# EAGLE schematic Lamp Logic Board_Combo (EAGLE 9.5.1)

## Sheet 1 of 3
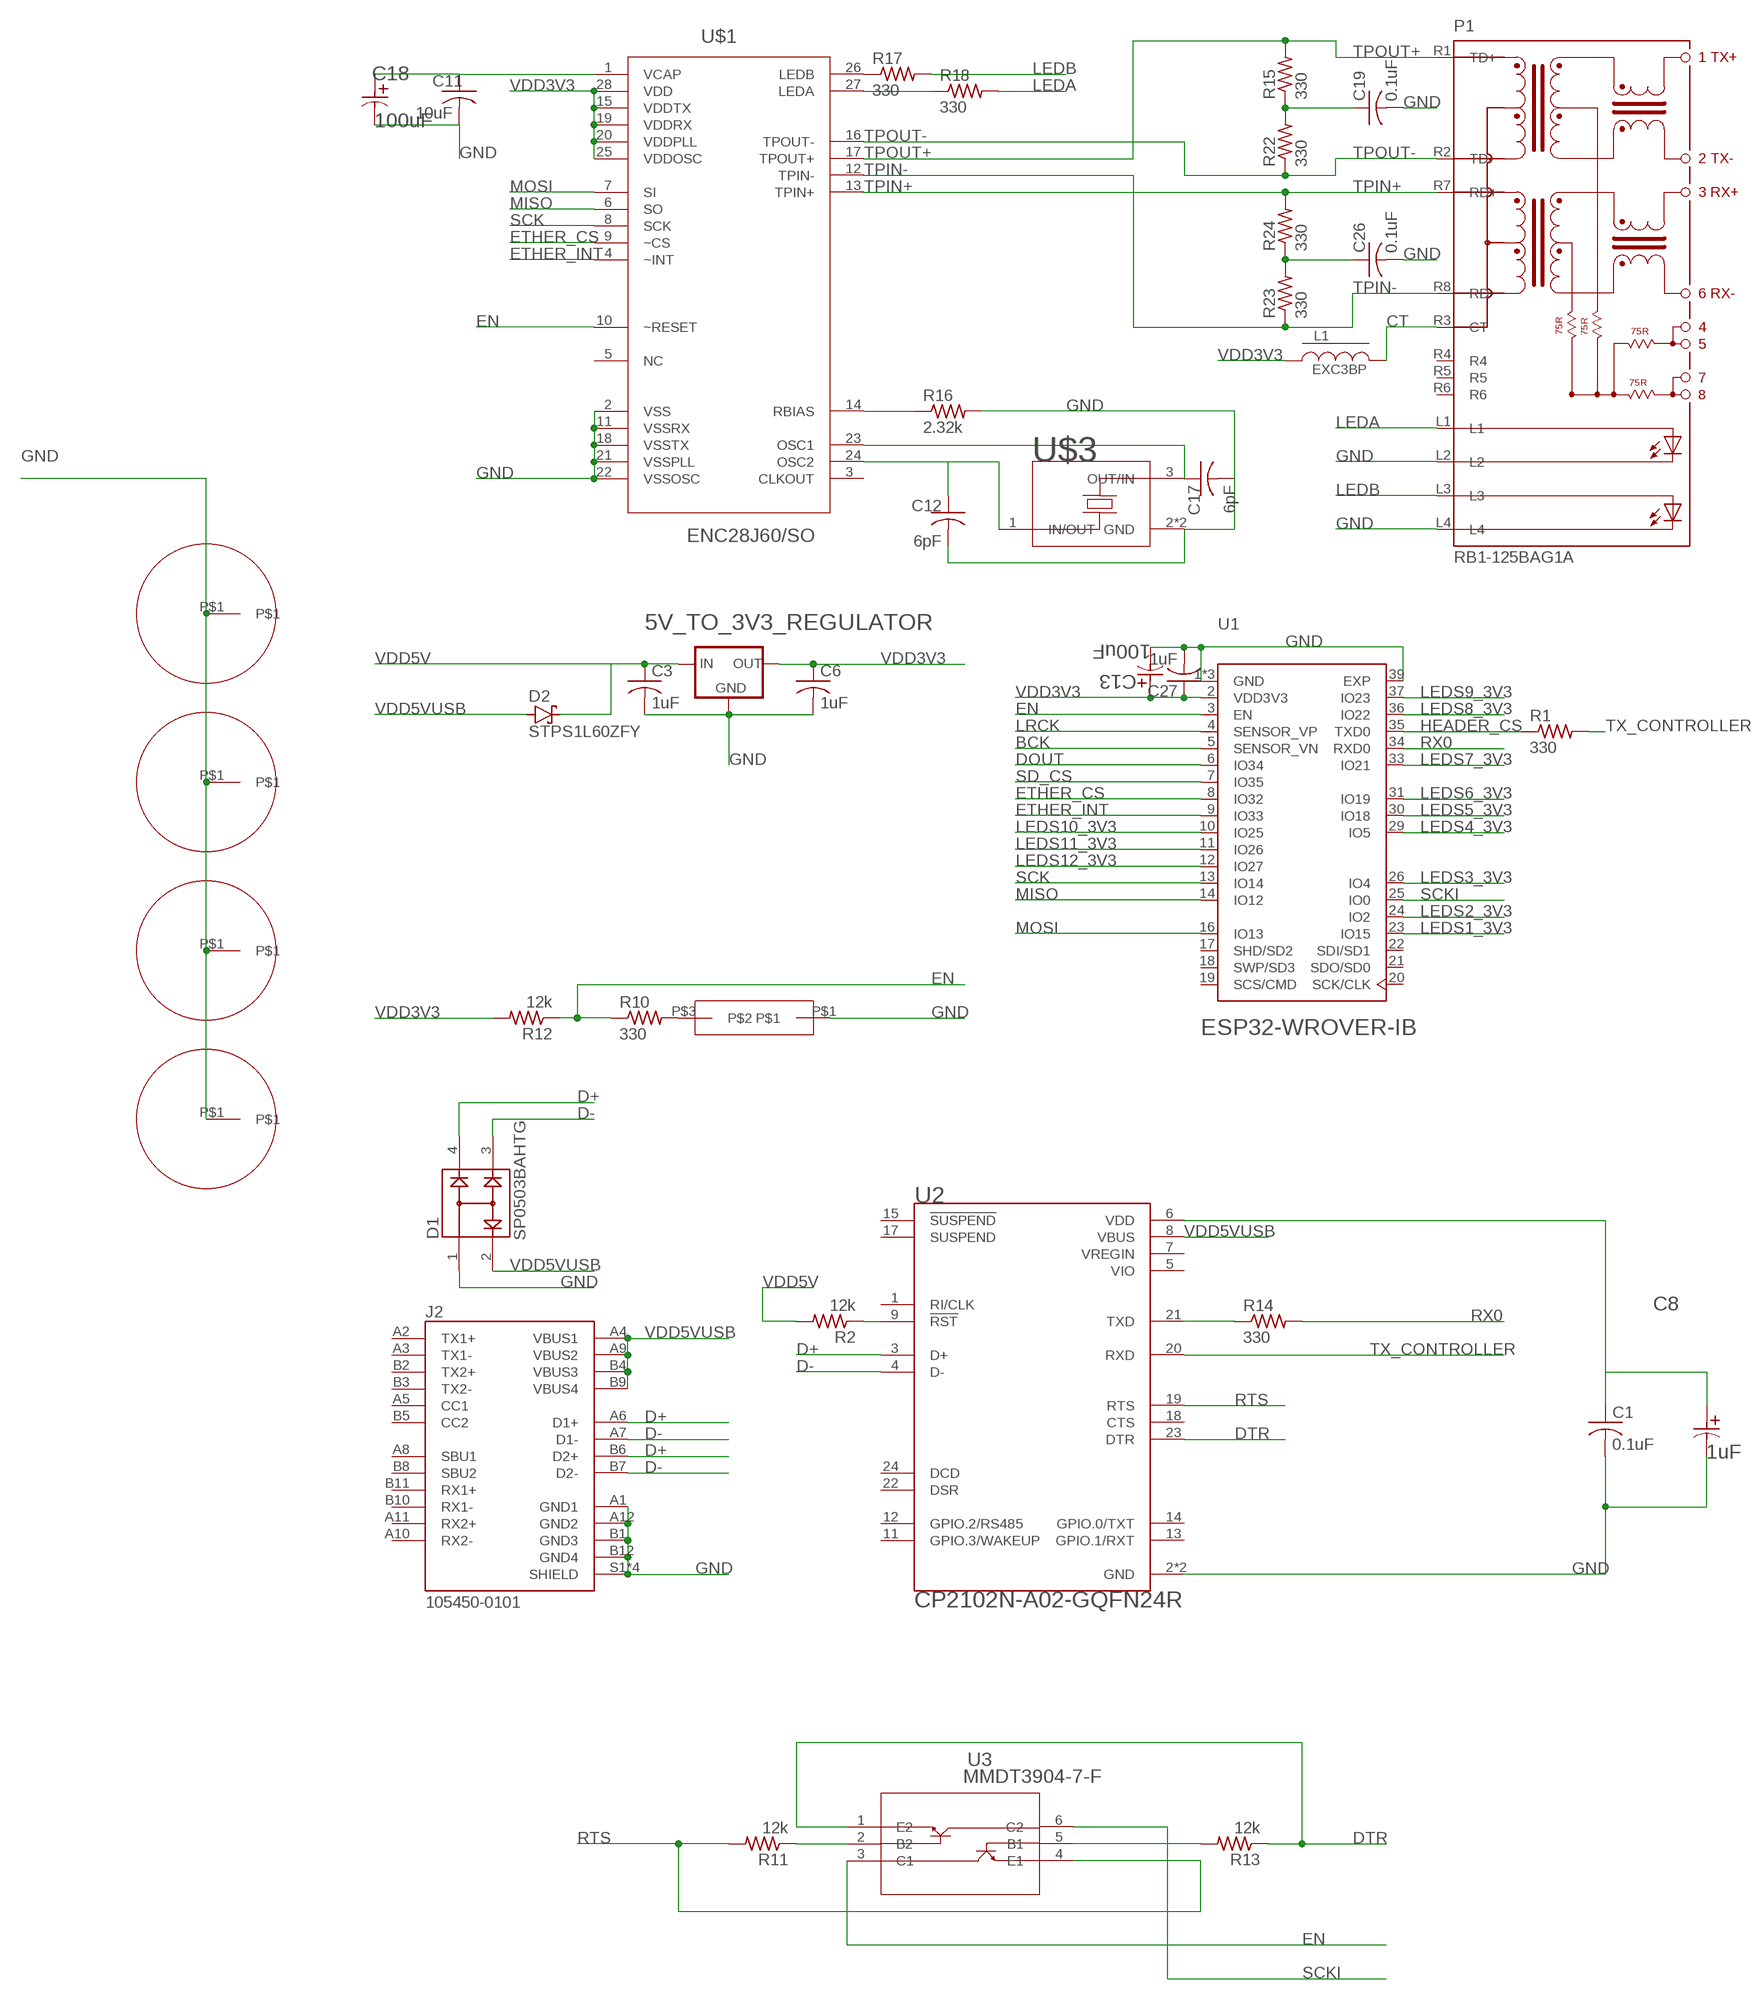
[diagram p0: schematic, sheet 1, part 1 of 2]
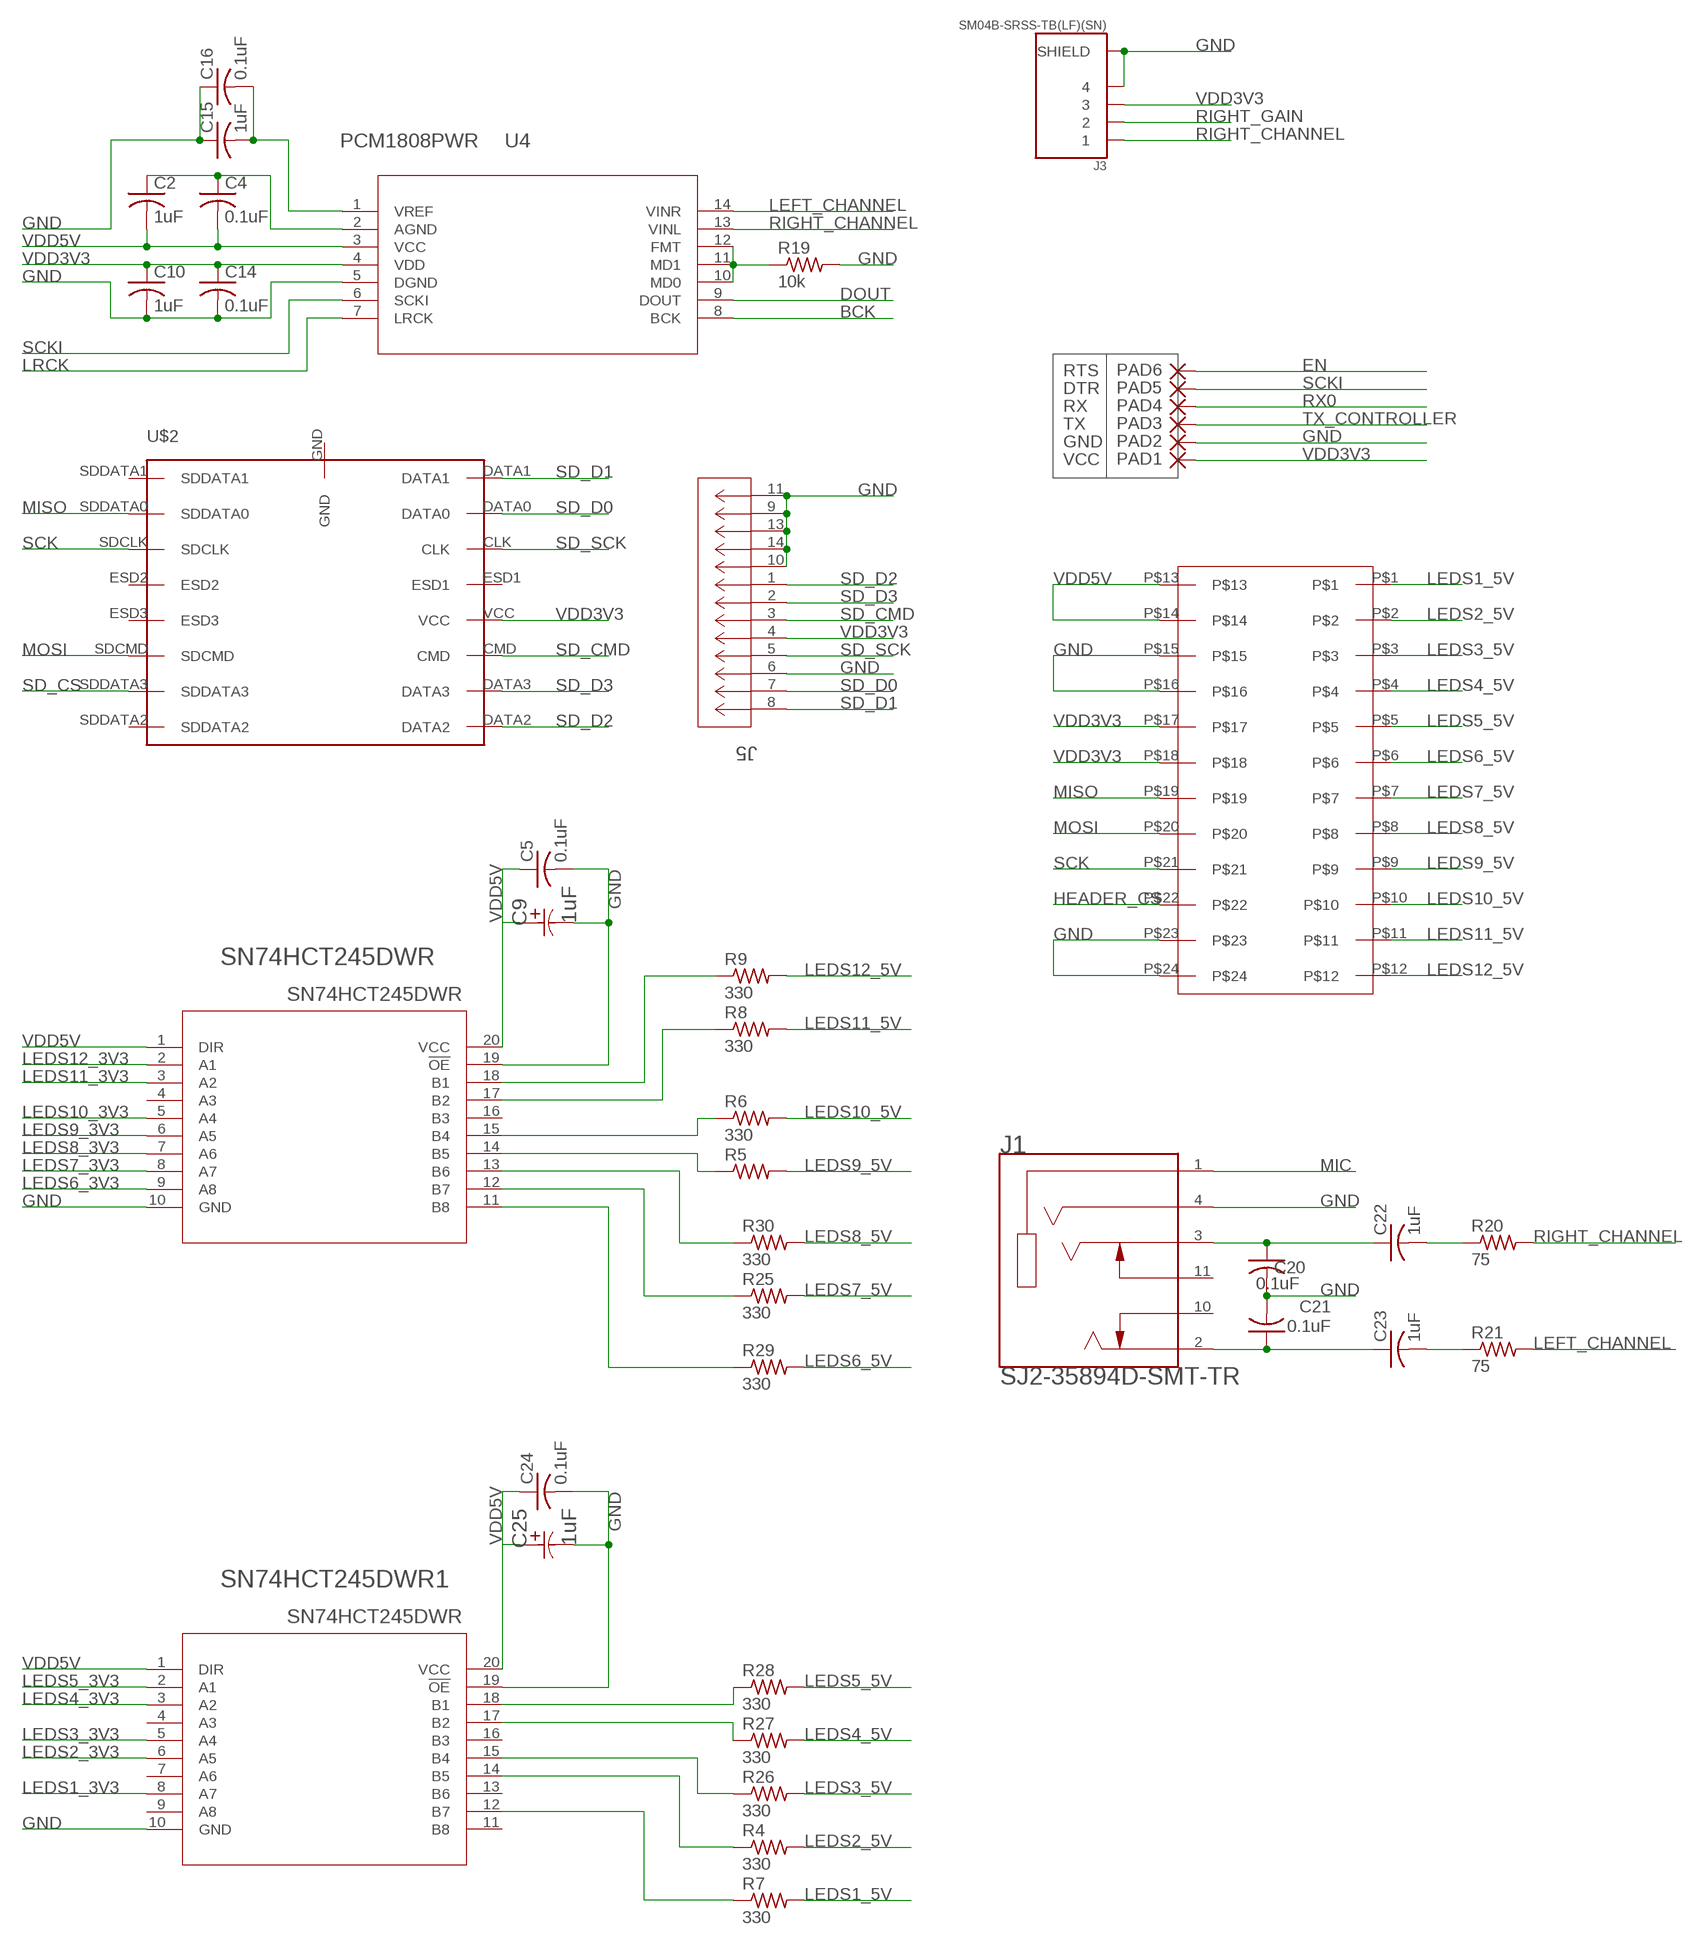
[diagram p1: schematic, sheet 1, part 2 of 2]

### Parts
5V_TO_3V3_REGULATOR  LM1117MP-1.8  [SOT223]
C1  0.1uF  C-USC0402  [C0402]
C2  1uF  C-USC0402  [C0402]
C3  1uF  C-USC0402  [C0402]
C4  0.1uF  C-USC0402  [C0402]
C5  0.1uF  C-USC0402  [C0402]
C6  1uF  C-USC0402  [C0402]
C8  1uF  EEEFC1V1R0R  [CAP_EEFC_B]
C9  1uF  EEEFC1V1R0R  [CAP_EEFC_B]
C10  1uF  C-USC0402  [C0402]
C11  10uF  C-USC0402  [C0402]
C12  6pF  C-USC0402  [C0402]
C13  100uF  EEEFC1V1R0R  [CAP_EEFC_B]
C14  0.1uF  C-USC0402  [C0402]
C15  1uF  C-USC0402  [C0402]
C16  0.1uF  C-USC0402  [C0402]
C17  6pF  C-USC0402  [C0402]
C18  100uF  EEEFC1V1R0R  [CAP_EEFC_B]
C19  0.1uF  C-USC0402  [C0402]
C20  0.1uF  C-USC0402  [C0402]
C21  0.1uF  C-USC0402  [C0402]
C22  1uF  C-USC0402  [C0402]
C23  1uF  C-USC0402  [C0402]
C24  0.1uF  C-USC0402  [C0402]
C25  1uF  EEEFC1V1R0R  [CAP_EEFC_B]
C26  0.1uF  C-USC0402  [C0402]
C27  1uF  C-USC0402  [C0402]
D1  SP0503BAHTG  [SOT143]
D2  STPS1L60ZFY  MBR0520LT1G  [SOD-123]
J1  SJ2-35894D-SMT-TR  [CUI_SJ2-35894D-SMT-TR]
J2  105450-0101  [MOLEX_105450-0101]
J3  SM04B-SRSS-TB(LF)(SN)  [JST_SM04B-SRSS-TB(LF)(SN)]
J5  LLC  [CON00218_8]
L1  EXC3BP  [L0603]
P1  RB1-125BAG1A  [WIZNET_RB1-125BAG1A]
PAD1  VCC  WIREPADSMD1,27-254  [SMD1,27-2,54]
PAD2  GND  WIREPADSMD1,27-254  [SMD1,27-2,54]
PAD3  TX  WIREPADSMD1,27-254  [SMD1,27-2,54]
PAD4  RX  WIREPADSMD1,27-254  [SMD1,27-2,54]
PAD5  DTR  WIREPADSMD1,27-254  [SMD1,27-2,54]
PAD6  RTS  WIREPADSMD1,27-254  [SMD1,27-2,54]
R1  330  RC0603JR-070RL  [RES_0603]
R2  12k  RC0603JR-070RL  [RES_0603]
R4  330  RC0603JR-070RL  [RES_0603]
R5  330  RC0603JR-070RL  [RES_0603]
R6  330  RC0603JR-070RL  [RES_0603]
R7  330  RC0603JR-070RL  [RES_0603]
R8  330  RC0603JR-070RL  [RES_0603]
R9  330  RC0603JR-070RL  [RES_0603]
R10  330  RC0603JR-070RL  [RES_0603]
R11  12k  RC0603JR-070RL  [RES_0603]
R12  12k  RC0603JR-070RL  [RES_0603]
R13  12k  RC0603JR-070RL  [RES_0603]
R14  330  RC0603JR-070RL  [RES_0603]
R15  330  RC0603JR-070RL  [RES_0603]
R16  2.32k  R-US_R1206  [R1206]
R17  330  RC0603JR-070RL  [RES_0603]
R18  330  RC0603JR-070RL  [RES_0603]
R19  10k  R-US_R1206  [R1206]
R20  75  R-US_R1206  [R1206]
R21  75  R-US_R1206  [R1206]
R22  330  RC0603JR-070RL  [RES_0603]
R23  330  RC0603JR-070RL  [RES_0603]
R24  330  RC0603JR-070RL  [RES_0603]
R25  330  RC0603JR-070RL  [RES_0603]
R26  330  RC0603JR-070RL  [RES_0603]
R27  330  RC0603JR-070RL  [RES_0603]
R28  330  RC0603JR-070RL  [RES_0603]
R29  330  RC0603JR-070RL  [RES_0603]
R30  330  RC0603JR-070RL  [RES_0603]
SN74HCT245DWR  SN74HCT245DWR  [DW20]
SN74HCT245DWR1  SN74HCT245DWR  [DW20]
U1  ESP32-WROVER-IB  ESP32-WROVER-I  [XCVR_ESP32-WROVER-I]
U2  CP2102N-A02-GQFN24R  [SILABS_CP2102N-A02-GQFN24R]
U3  MMDT3904-7-F  [SOT-363]
U4  PCM1808PWR  [PW14]
U$1  ENC28J60/SO  [SOIC127P1034X264-28N]
U$2  CM1624-08DE  [CM1624-08DE]
U$3  ECS-250-10-37B-CTN-TR  [ECS-250-10-37B-CTN-TR]
U$4  QUICKFIT_RISER_THING  [QUICKFIT_RISER_THING]
U$5  QUICKFIT_RISER_THING  [QUICKFIT_RISER_THING]
U$6  QUICKFIT_RISER_THING  [QUICKFIT_RISER_THING]
U$7  TL1014BF160QG  [TL1014BF160QG]
U$8  QUICKFIT_RISER_THING  [QUICKFIT_RISER_THING]
U$9  MY_HEADER  [MY_HEADER]

### Nets
BCK [LED Data]: U1.5(SENSOR_VN) U4.8(BCK)
CT [LED Data]: L1.2 P1.R3(CT)
D+ [LED Data]: D1.4 J2.A6(D1+) J2.B6(D2+) U2.3(D+)
D- [LED Data]: D1.3 J2.A7(D1-) J2.B7(D2-) U2.4(D-)
DOUT [LED Data]: U1.6(IO34) U4.9(DOUT)
DTR [LED Data]: R13.1 U2.23(DTR) U3.1(E2)
EN [LED Data]: PAD6.1(P) R10.1 R12.1 U1.3(EN) U3.3(C1) U$1.10(~RESET)
ETHER_CS [LED Data]: U1.8(IO32) U$1.9(~CS)
ETHER_INT [LED Data]: U1.9(IO33) U$1.4(~INT)
GND: 5V_TO_3V3_REGULATOR.1(GND) C1.2 C3.2 C5.2 C6.2 C8.2 C9.2 C10.2 C11.2 C12.2 C13.2 C14.2 C15.1 C16.1 C17.2 C18.2 C19.2 C20.2 C21.2 C24.2 C25.2 C26.2 C27.2 D1.1 J1.4(RING2) J2.A1(GND1) J2.A12(GND2) J2.B1(GND3) J2.B12(GND4) J2.S1(SHIELD) J2.S2(SHIELD) J2.S3(SHIELD) J2.S4(SHIELD) J3.4 J3.S1(SHIELD) J3.S2(SHIELD) J5.6 J5.9 J5.10 J5.11 J5.13 J5.14 P1.L2 P1.L4 PAD2.1(P) R16.2 R19.2 SN74HCT245DWR1.10(GND) SN74HCT245DWR1.19(!OE) SN74HCT245DWR.10(GND) SN74HCT245DWR.19(!OE) U1.1(GND) U1.15(GND) U1.38(GND) U1.39(EXP) U2.2(GND) U2.25(GND) U4.5(DGND) U$1.2(VSS) U$1.11(VSSRX) U$1.18(VSSTX) U$1.21(VSSPLL) U$1.22(VSSOSC) U$3.2(GND) U$3.4(GND) U$4.P$1 U$5.P$1 U$6.P$1 U$7.P$1 U$8.P$1 U$9.P$15 U$9.P$16 U$9.P$23 U$9.P$24
HEADER_CS [LED Data]: R1.1 U1.35(TXD0) U$9.P$22
LEDA [LED Data]: P1.L1 R18.2
LEDB [LED Data]: P1.L3 R17.2
LEDS1_3V3 [LED Data]: SN74HCT245DWR1.8(A7) U1.23(IO15)
LEDS1_5V [LED Data]: R7.2 U$9.P$1
LEDS2_3V3 [LED Data]: SN74HCT245DWR1.6(A5) U1.24(IO2)
LEDS2_5V [LED Data]: R4.2 U$9.P$2
LEDS3_3V3 [LED Data]: SN74HCT245DWR1.5(A4) U1.26(IO4)
LEDS3_5V [LED Data]: R26.2 U$9.P$3
LEDS4_3V3 [LED Data]: SN74HCT245DWR1.3(A2) U1.29(IO5)
LEDS4_5V [LED Data]: R27.2 U$9.P$4
LEDS5_3V3 [LED Data]: SN74HCT245DWR1.2(A1) U1.30(IO18)
LEDS5_5V [LED Data]: R28.2 U$9.P$5
LEDS6_3V3 [LED Data]: SN74HCT245DWR.9(A8) U1.31(IO19)
LEDS6_5V [LED Data]: R29.2 U$9.P$6
LEDS7_3V3 [LED Data]: SN74HCT245DWR.8(A7) U1.33(IO21)
LEDS7_5V [LED Data]: R25.2 U$9.P$7
LEDS8_3V3 [LED Data]: SN74HCT245DWR.7(A6) U1.36(IO22)
LEDS8_5V [LED Data]: R30.2 U$9.P$8
LEDS9_3V3 [LED Data]: SN74HCT245DWR.6(A5) U1.37(IO23)
LEDS9_5V [LED Data]: R5.2 U$9.P$9
LEDS10_3V3 [LED Data]: SN74HCT245DWR.5(A4) U1.10(IO25)
LEDS10_5V [LED Data]: R6.2 U$9.P$10
LEDS11_3V3 [LED Data]: SN74HCT245DWR.3(A2) U1.11(IO26)
LEDS11_5V [LED Data]: R8.2 U$9.P$11
LEDS12_3V3 [LED Data]: SN74HCT245DWR.2(A1) U1.12(IO27)
LEDS12_5V [LED Data]: R9.2 U$9.P$12
LEFT_CHANNEL [LED Data]: R21.2 U4.14(VINR)
LRCK [LED Data]: U1.4(SENSOR_VP) U4.7(LRCK)
MIC [LED Data]: J1.1(SLEEVE)
MISO [LED Data]: U1.14(IO12) U$1.6(SO) U$2.SDDATA0 U$9.P$19
MOSI [LED Data]: U1.16(IO13) U$1.7(SI) U$2.SDCMD U$9.P$20
N$1 [LED Data]: R9.1 SN74HCT245DWR.18(B1)
N$2 [LED Data]: C2.1 C4.1 U4.2(AGND)
N$3 [LED Data]: C20.1 C22.1 J1.3(RING1)
N$4 [LED Data]: C21.1 C23.1 J1.2(TIP)
N$5 [LED Data]: C1.1 C8.1 U2.6(VDD)
N$6 [LED Data]: R7.1 SN74HCT245DWR1.12(B7)
N$7 [LED Data]: R11.1 U3.2(B2)
N$8 [LED Data]: R13.2 U3.5(B1)
N$9: R10.2 U$7.P$3
N$10 [LED Data]: R28.1 SN74HCT245DWR1.18(B1)
N$11 [LED Data]: R6.1 SN74HCT245DWR.15(B4)
N$12 [LED Data]: R5.1 SN74HCT245DWR.14(B5)
N$13 [LED Data]: R27.1 SN74HCT245DWR1.17(B2)
N$14 [LED Data]: R8.1 SN74HCT245DWR.17(B2)
N$15 [LED Data]: R26.1 SN74HCT245DWR1.15(B4)
N$16 [LED Data]: C22.2 R20.1
N$17 [LED Data]: C15.2 C16.2 U4.1(VREF)
N$18 [LED Data]: R14.1 U2.21(TXD)
N$19 [LED Data]: C11.1 C18.1 U$1.1(VCAP)
N$20 [LED Data]: R16.1 U$1.14(RBIAS)
N$21 [LED Data]: C12.1 U$1.24(OSC2) U$3.1(IN/OUT)
N$22 [LED Data]: C17.1 U$1.23(OSC1) U$3.3(OUT/IN)
N$23 [LED Data]: R17.1 U$1.26(LEDB)
N$24 [LED Data]: C23.2 R21.1
N$25 [LED Data]: R18.1 U$1.27(LEDA)
N$26 [LED Data]: R29.1 SN74HCT245DWR.11(B8)
N$27 [LED Data]: R4.1 SN74HCT245DWR1.14(B5)
N$28 [LED Data]: R2.1 U2.9(!RST)
N$30 [LED Data]: R19.1 U4.10(MD0) U4.11(MD1) U4.12(FMT)
N$31 [LED Data]: C26.1 R23.2 R24.1
N$32 [LED Data]: C19.1 R15.1 R22.2
N$34 [LED Data]: R30.1 SN74HCT245DWR.13(B6)
N$35 [LED Data]: R25.1 SN74HCT245DWR.12(B7)
RIGHT_CHANNEL [LED Data]: J3.1 R20.2 U4.13(VINL)
RIGHT_GAIN [LED Data]: J3.2
RTS [LED Data]: R11.2 U2.19(RTS) U3.4(E1)
RX0 [LED Data]: PAD4.1(P) R14.2 U1.34(RXD0)
SCK [LED Data]: U1.13(IO14) U$1.8(SCK) U$2.SDCLK U$9.P$21
SCKI [LED Data]: PAD5.1(P) U1.25(IO0) U3.6(C2) U4.6(SCKI)
SD_CMD [LED Data]: J5.3 U$2.CMD
SD_CS [LED Data]: U1.7(IO35) U$2.SDDATA3
SD_D0 [LED Data]: J5.7 U$2.DATA0
SD_D1 [LED Data]: J5.8 U$2.DATA1
SD_D2 [LED Data]: J5.1 U$2.DATA2
SD_D3 [LED Data]: J5.2 U$2.DATA3
SD_SCK [LED Data]: J5.5 U$2.CLK
TPIN+ [LED Data]: P1.R7(RD+) R24.2 U$1.13(TPIN+)
TPIN- [LED Data]: P1.R8(RD-) R23.1 U$1.12(TPIN-)
TPOUT+ [LED Data]: P1.R1(TD+) R15.2 U$1.17(TPOUT+)
TPOUT- [LED Data]: P1.R2(TD-) R22.1 U$1.16(TPOUT-)
TX_CONTROLLER [LED Data]: PAD3.1(P) R1.2 U2.20(RXD)
VDD3V3: 5V_TO_3V3_REGULATOR.2(OUT) 5V_TO_3V3_REGULATOR.4(OUT) C6.1 C10.1 C13.1 C14.1 C27.1 J3.3 J5.4 L1.1 PAD1.1(P) R12.2 U1.2(VDD3V3) U4.4(VDD) U$1.15(VDDTX) U$1.19(VDDRX) U$1.20(VDDPLL) U$1.25(VDDOSC) U$1.28(VDD) U$2.VCC U$9.P$17 U$9.P$18
VDD5V: 5V_TO_3V3_REGULATOR.3(IN) C2.2 C3.1 C4.2 C5.1 C9.1 C24.1 C25.1 D2.C R2.2 SN74HCT245DWR1.1(DIR) SN74HCT245DWR1.20(VCC) SN74HCT245DWR.1(DIR) SN74HCT245DWR.20(VCC) U4.3(VCC) U$9.P$13 U$9.P$14
VDD5VUSB: D1.2 D2.A J2.A4(VBUS1) J2.A9(VBUS2) J2.B4(VBUS3) J2.B9(VBUS4) U2.8(VBUS)
Unconnected: J1.10(TIP_SWITCH) J1.11(RING1_SWITCH) J2.A2(TX1+) J2.A3(TX1-) J2.A5(CC1) J2.A8(SBU1) J2.A10(RX2-) J2.A11(RX2+) J2.B2(TX2+) J2.B3(TX2-) J2.B5(CC2) J2.B8(SBU2) J2.B10(RX1-) J2.B11(RX1+) P1.R4 P1.R5 P1.R6 SN74HCT245DWR1.4(A3) SN74HCT245DWR1.7(A6) SN74HCT245DWR1.9(A8) SN74HCT245DWR1.11(B8) SN74HCT245DWR1.13(B6) SN74HCT245DWR1.16(B3) SN74HCT245DWR.4(A3) SN74HCT245DWR.16(B3) U1.17(SHD/SD2) U1.18(SWP/SD3) U1.19(SCS/CMD) U1.20(SCK/CLK) U1.21(SDO/SD0) U1.22(SDI/SD1) U2.1(RI/CLK) U2.5(VIO) U2.11(GPIO.3/WAKEUP) U2.12(GPIO.2/RS485) U2.13(GPIO.1/RXT) U2.14(GPIO.0/TXT) U2.15(!SUSPEND) U2.17(SUSPEND) U2.18(CTS) U2.22(DSR) U2.24(DCD) U$1.3(CLKOUT) U$1.5(NC) U$2.ESD1 U$2.ESD2 U$2.ESD3 U$2.GND U$2.SDDATA1 U$2.SDDATA2

## Sheet 2 of 3
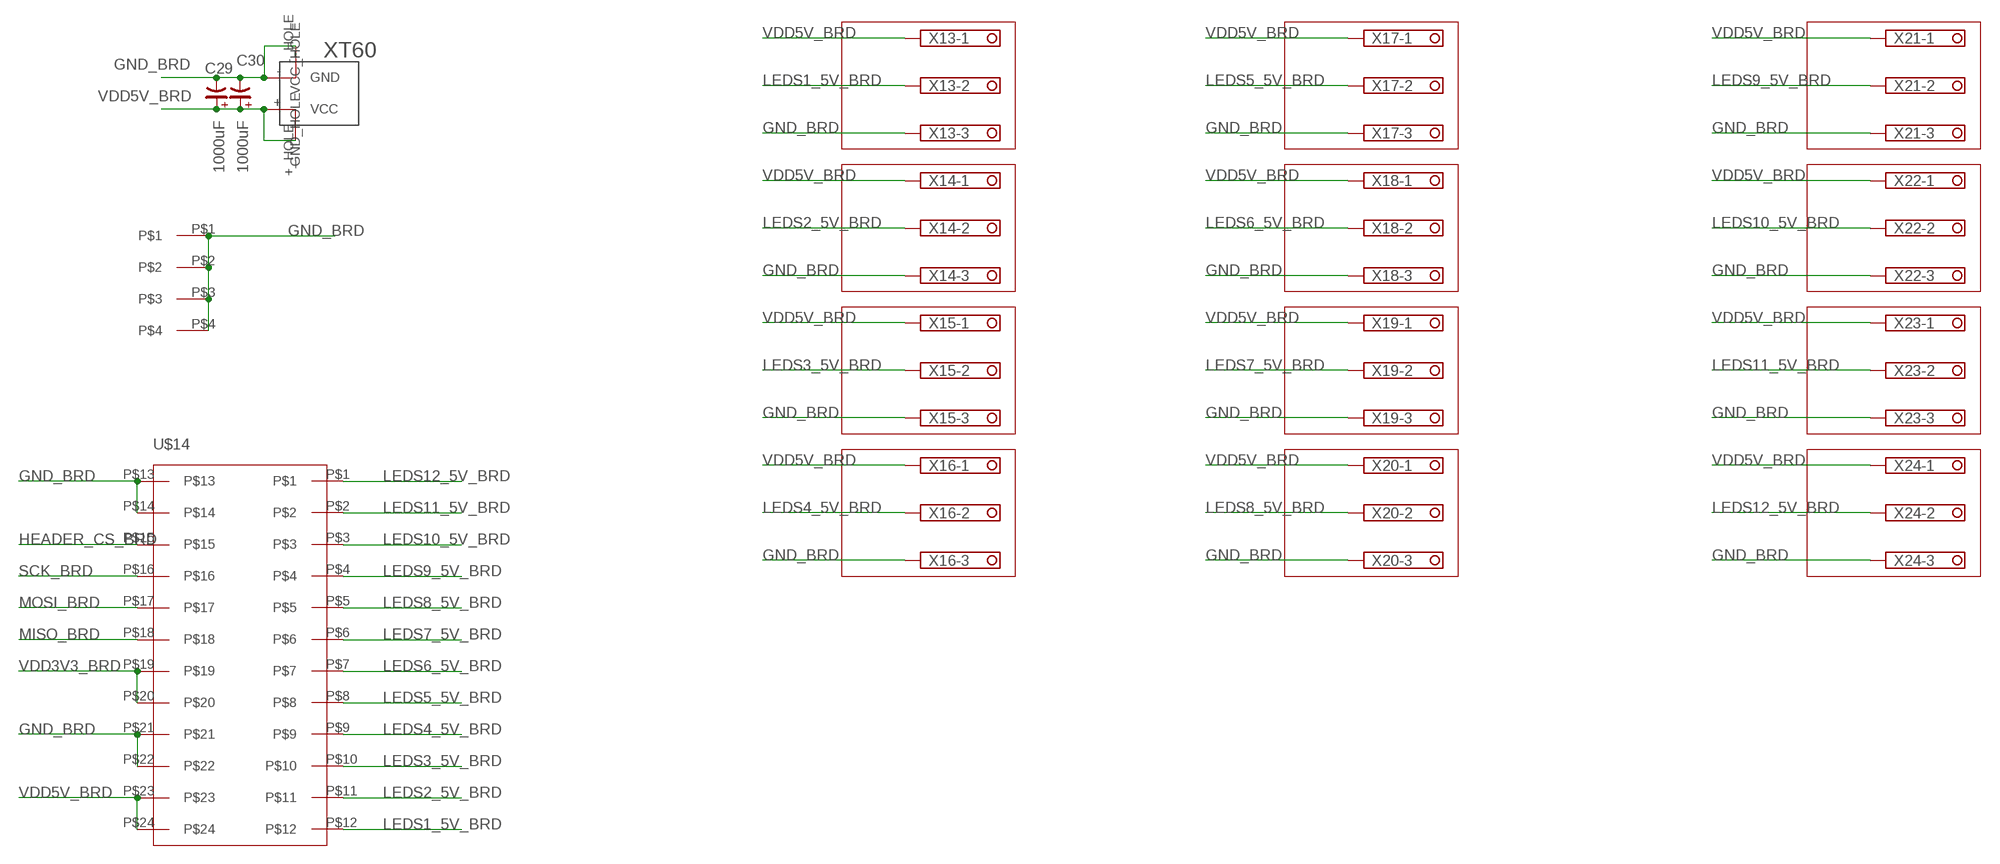
[diagram p2: schematic, sheet 2]

### Parts
C29  1000uF  CP_SV-G  [CSV-G]
C30  1000uF  CP_SV-G  [CSV-G]
U$13,U$14  POWERBOARD_TEMPLATEPOWERBOARD_TEMPLATE  [4,PIECE]
U$14  MY_HEADER  [MY_HEADER]
U$15  XT60  [XT60]
X13  TERMINAL-BLOCK-3.5MM-3-PIN-LONG-PAD  [TERMINAL-BLOCK-3-PIN-3.5MM-LONG-PAD]
X14  TERMINAL-BLOCK-3.5MM-3-PIN-LONG-PAD  [TERMINAL-BLOCK-3-PIN-3.5MM-LONG-PAD]
X15  TERMINAL-BLOCK-3.5MM-3-PIN-LONG-PAD  [TERMINAL-BLOCK-3-PIN-3.5MM-LONG-PAD]
X16  TERMINAL-BLOCK-3.5MM-3-PIN-LONG-PAD  [TERMINAL-BLOCK-3-PIN-3.5MM-LONG-PAD]
X17  TERMINAL-BLOCK-3.5MM-3-PIN-LONG-PAD  [TERMINAL-BLOCK-3-PIN-3.5MM-LONG-PAD]
X18  TERMINAL-BLOCK-3.5MM-3-PIN-LONG-PAD  [TERMINAL-BLOCK-3-PIN-3.5MM-LONG-PAD]
X19  TERMINAL-BLOCK-3.5MM-3-PIN-LONG-PAD  [TERMINAL-BLOCK-3-PIN-3.5MM-LONG-PAD]
X20  TERMINAL-BLOCK-3.5MM-3-PIN-LONG-PAD  [TERMINAL-BLOCK-3-PIN-3.5MM-LONG-PAD]
X21  TERMINAL-BLOCK-3.5MM-3-PIN-LONG-PAD  [TERMINAL-BLOCK-3-PIN-3.5MM-LONG-PAD]
X22  TERMINAL-BLOCK-3.5MM-3-PIN-LONG-PAD  [TERMINAL-BLOCK-3-PIN-3.5MM-LONG-PAD]
X23  TERMINAL-BLOCK-3.5MM-3-PIN-LONG-PAD  [TERMINAL-BLOCK-3-PIN-3.5MM-LONG-PAD]
X24  TERMINAL-BLOCK-3.5MM-3-PIN-LONG-PAD  [TERMINAL-BLOCK-3-PIN-3.5MM-LONG-PAD]

### Nets
GND_BRD: C29.- C30.- U$13,U$14.P$1 U$13,U$14.P$2 U$13,U$14.P$3 U$13,U$14.P$4 U$14.P$13 U$14.P$14 U$14.P$21 U$14.P$22 U$15.-(GND) U$15.-_HOLE(GND_HOLE) X13.3 X14.3 X15.3 X16.3 X17.3 X18.3 X19.3 X20.3 X21.3 X22.3 X23.3 X24.3
HEADER_CS_BRD: U$14.P$15
LEDS1_5V_BRD: U$14.P$12 X13.2
LEDS2_5V_BRD: U$14.P$11 X14.2
LEDS3_5V_BRD: U$14.P$10 X15.2
LEDS4_5V_BRD: U$14.P$9 X16.2
LEDS5_5V_BRD: U$14.P$8 X17.2
LEDS6_5V_BRD: U$14.P$7 X18.2
LEDS7_5V_BRD: U$14.P$6 X19.2
LEDS8_5V_BRD: U$14.P$5 X20.2
LEDS9_5V_BRD: U$14.P$4 X21.2
LEDS10_5V_BRD: U$14.P$3 X22.2
LEDS11_5V_BRD: U$14.P$2 X23.2
LEDS12_5V_BRD: U$14.P$1 X24.2
MISO_BRD: U$14.P$18
MOSI_BRD: U$14.P$17
SCK_BRD: U$14.P$16
VDD3V3_BRD: U$14.P$19 U$14.P$20
VDD5V_BRD: C29.+ C30.+ U$14.P$23 U$14.P$24 U$15.+(VCC) U$15.+_HOLE(VCC_HOLE) X13.1 X14.1 X15.1 X16.1 X17.1 X18.1 X19.1 X20.1 X21.1 X22.1 X23.1 X24.1

## Sheet 3 of 3

## Power pins joined to a net without a drawn wire
VREGIN: U2.7(VREGIN)

## Library data of the parts
5V_TO_3V3_REGULATOR = lm1117:LM1117?-*: 800mA Low-Dropout Linear Regulator Source: http://ww1.microchip.com/downloads/en/DeviceDoc/39760d.pdf; MF: Texas Instruments; MPN: LM1117MP-1.8; OC_FARNELL: 1469053; OC_NEWARK: 41K3467
C1-C4 C6 C10-C12 C14-C17 C19 C22 C23 C26 C27 = resistor:C-US: CAPACITOR, American symbol
C5 C20 C21 C24 = adafruit:C-US: CAPACITOR, American symbol
C8 C9 C13 C18 C25 = EEE-FC1V1R0R:EEEFC1V1R0R; MANUFACTURER_PART_NUMBER: EEEFC1V1R0R; VENDOR: Panasonic
C29 C30 = rc-master-smd:CP_: POLARIZED CAP
D1 = SP0503BAHTG:SP0503BAHTG: TVS DIODE 5.5VWM 8.5VC SOT143; DESCRIPTION: SP050xBA Series 8 V 30 pF Uni-Directional SMT TVS Avalanche Diode Array SOT-143; DIGI-KEY_PART_NUMBER: F2715CT-ND; DIGI-KEY_PURCHASE_URL: https://www.digikey.com/product-detail/en/littelfuse-inc/SP0503BAHTG/F2715CT-ND/1154322?utm_source=snapeda&utm_medium=aggregator&utm_campaign=symbol; MF: Littelfuse Inc.; MP: SP0503BAHTG; PACKAGE: SOT-143 Littelfuse
D2 = Diodes:MBR0520LT1G: DIODE SCHOTTKY 20V 500MA SOD123 Manufacturer's datasheet <https://www.onsemi.com/pub/Collateral/MBR0520LT1-D.PDF>; CREATED_BY: PCBLayout.com; DIGIKEY_PART_NUMBER: MBR0520LT1GOSTR-ND; MANUFACTURER: ON Semiconductor; MPN: MBR0520LT1G; PACKAGE: SOD-123
J1 = SJ2-35894D-SMT-TR:SJ2-35894D-SMT-TR: 4 conductors, 3.5mm, SMT Audio Jack w/ 2 Switch; CUI_PURCHASE_URL: https://www.cui.com/product/interconnect/connectors/audio-connectors/jacks/sj2-3589x-smt-series?utm_source=snapeda.com&utm_medium=referral&utm_campaign=snapedaBOM; DESCRIPTION: 3.5 mm, Stereo, Right Angle, Surface Mount _SMT_, Audio Jack Connector; DIGI-KEY_PART_NUMBER: CP-SJ2-35894D-SMT-CT-ND; DIGI-KEY_PURCHASE_URL: https://www.digikey.com/product-detail/en/cui-inc/SJ2-35894D-SMT-TR/CP-SJ2-35894D-SMT-CT-ND/6619623?utm_source=snapeda&utm_medium=aggregator&utm_campaign=symbol; MF: CUI Inc.; MP: SJ2-35894D-SMT-TR; PACKAGE: None
J2 = 105450-0101:105450-0101: USB Shielded I/O Receptacle; Type C; Right Angle; Surface Mount; Gold over Nickel; DESCRIPTION: USB Shielded I/O Receptacle; Type C; Right Angle; Surface Mount; Gold over Nickel; DIGI-KEY_PART_NUMBER: WM12856CT-ND; DIGI-KEY_PURCHASE_URL: https://www.digikey.com/product-detail/en/molex/1054500101/WM12856CT-ND/5843891?utm_source=snapeda&utm_medium=aggregator&utm_campaign=symbol; MF: Molex; MP: 1054500101; PACKAGE: None
J3 = SM04B-SRSS-TB_LF__SN_:SM04B-SRSS-TB(LF)(SN): SH Series 1.0 mm Pitch 2 Position Single Row Side Entry Shrouded Header; AVAILABILITY: Unavailable; DESCRIPTION: SH Series 1.0 mm Pitch 2 Position Single Row Side Entry Shrouded Header; MF: JST Sales; MP: SM04B-SRSS-TB_LF__SN_; PACKAGE: None; PRICE: None
J5 = 5027740891:LLC; MANUFACTURER_PART_NUMBER: LLC; VENDOR: Molex Connector Corporation
L1 = ferrite:EXC3BP: Chip Bead Core
P1 = RB1-125BAG1A:RB1-125BAG1A: Accessory RJ-45 With Transformer Connector - UDE; AVAILABILITY: Unavailable; DESCRIPTION: Accessory RJ-45 With Transformer Connector - UDE; MF: WIZnet; MP: RB1-125BAG1A; PACKAGE: HVQFN-36 NXP Semiconductors; PRICE: None
PAD1-PAD6 = wirepad:WIREPAD: Wire PAD connect wire on PCB
R1 R2 R4-R15 R17 R18 R22-R30 = Resistor_Capacitor:RC0603JR-070RL: RES SMD 0 OHM JUMPER 1/10W 0603 Manufacturer's datasheet <http://www.yageo.com/documents/recent/PYu-RC_Group_51_RoHS_L_10.pdf>; CREATED_BY: PCBLayout.com; DIGIKEY_PART_NUMBER: 311-0.0GRTR-ND; MANUFACTURER: Yageo; MPN: RC0603JR-070RL; PACKAGE: SMD 0603
R16 R19-R21 = resistor:R-US_: RESISTOR, American symbol
SN74HCT245DWR SN74HCT245DWR1 = SN74HCT245DWR :SN74HCT245DWR; MANUFACTURER_PART_NUMBER: SN74HCT245DWR; VENDOR: Texas Instruments
U1 = ESP32-WROVER-I:ESP32-WROVER-I: Module: combo; GPIO, I2C x2, I2S x2, SDIO, SPI x3, UART x3; U.FL; AVAILABILITY: Unavailable; DESCRIPTION: Module: combo; GPIO, I2C x2, I2S x2, SDIO, SPI x3, UART x3; U.FL; MF: Espressif Systems; MP: ESP32-WROVER-I; PACKAGE: Module Espressif Systems; PRICE: None
U2 = CP2102N-A02-GQFN20R:CP2102N-A02-GQFN24R: IC USB TO UART BRIDGE QFN20
U3 = MMDT3904:MMDT3904-7-F; MANUFACTURER_PART_NUMBER: MMDT39047F; VENDOR: Diodes Inc
U4 = PCM1808PWR:PCM1808PWR; MANUFACTURER_PART_NUMBER: PCM1808PWR; VENDOR: Texas Instruments
U$1 = ENC28J60_SO:ENC28J60/SO: Stand-Alone Ethernet Controller;; DESCRIPTION: ENC28J60 Series 3.3 V Stand-Alone Ethernet Controller with SPI Interface-SSOP-28; DIGI-KEY_PART_NUMBER: ENC28J60/SS-ND; DIGI-KEY_PURCHASE_URL: https://www.digikey.com/product-detail/en/microchip-technology/ENC28J60-SS/ENC28J60-SS-ND/857584?utm_source=snapeda&utm_medium=aggregator&utm_campaign=symbol; MF: Microchip; MP: ENC28J60/SS; PACKAGE: SSOP-28 Microchip
U$2 = CM1624-08DE:CM1624-08DE
U$3 = ECS-250-10-37B-CTN-TR:ECS-250-10-37B-CTN-TR
U$4-U$6 U$8 = QUICKFIT_RISER_THING:QUICKFIT_RISER_THING
U$7 = TL1014BF160QG:TL1014BF160QG
U$9 U$14 = MY_HEADER:MY_HEADER
U$13,U$14 = QUICKFIT_RISER_THING:POWERBOARD_TEMPLATE
U$15 = XT60:XT60: XT60
X13-X24 = Rembrandt Electronics - Terminal Block 3-5mm v1-0:TERMINAL-BLOCK-3.5MM-3-PIN: Terminal Block 3.5mm Pitch: 3,5 mm Number of pins: 3 Created by Rembrandt Electronics www.rembrandtelectronics.com

## Net classes
1 LED Data: width 0.305 mm, drill 0.25 mm